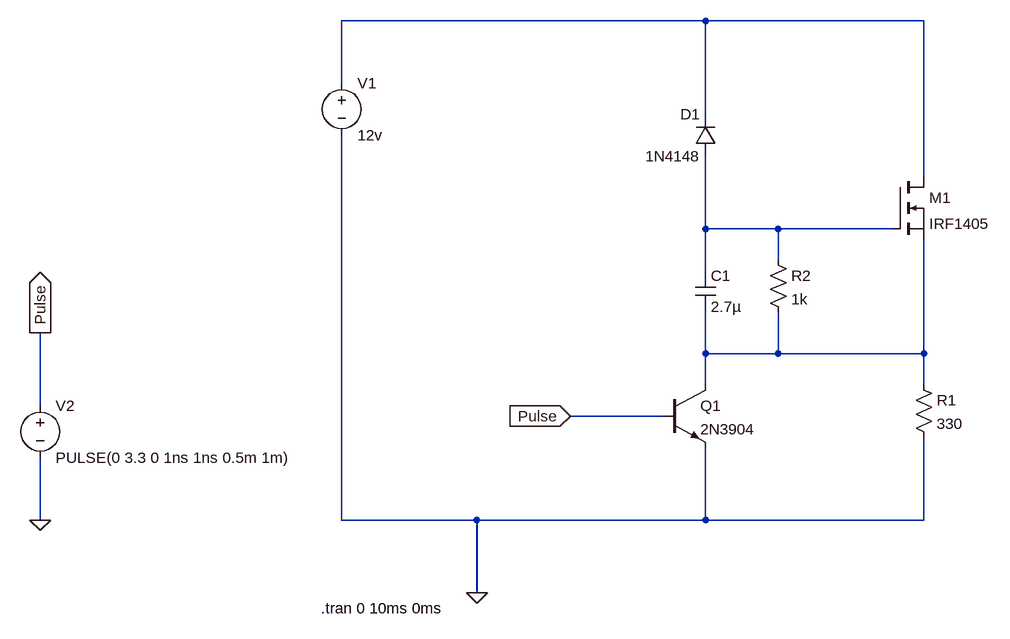
[diagram p0: schematic Boostrap.asc]
Boostrap.asc, the LTspice schematic file:
Version 4
SHEET 1 1072 808
WIRE 624 -112 64 -112
WIRE 960 -112 624 -112
WIRE 64 -16 64 -112
WIRE 624 32 624 -112
WIRE 960 128 960 -112
WIRE 624 208 624 96
WIRE 736 208 624 208
WIRE 912 208 736 208
WIRE 736 256 736 208
WIRE 624 272 624 208
WIRE 624 400 624 336
WIRE 736 400 736 336
WIRE 736 400 624 400
WIRE 960 400 960 224
WIRE 960 400 736 400
WIRE 624 448 624 400
WIRE 960 448 960 400
WIRE -400 480 -400 368
WIRE 560 496 416 496
WIRE -400 656 -400 560
WIRE 64 656 64 64
WIRE 272 656 64 656
WIRE 624 656 624 544
WIRE 624 656 272 656
WIRE 960 656 960 528
WIRE 960 656 624 656
WIRE 272 768 272 656
FLAG 272 768 0
FLAG -400 368 Pulse
IOPIN -400 368 Out
FLAG -400 656 0
FLAG 416 496 Pulse
IOPIN 416 496 In
SYMBOL voltage 64 -32 R0
WINDOW 123 0 0 Left 0
WINDOW 39 0 0 Left 0
SYMATTR InstName V1
SYMATTR Value 12v
SYMBOL nmos 912 128 R0
SYMATTR InstName M1
SYMATTR Value IRF1405
SYMBOL diode 640 96 R180
WINDOW 0 24 64 Left 2
WINDOW 3 24 0 Left 2
SYMATTR InstName D1
SYMATTR Value 1N4148
SYMBOL cap 608 272 R0
SYMATTR InstName C1
SYMATTR Value 2.7µ
SYMBOL res 944 432 R0
SYMATTR InstName R1
SYMATTR Value 330
SYMBOL npn 560 448 R0
SYMATTR InstName Q1
SYMATTR Value 2N3904
SYMBOL voltage -400 464 R0
WINDOW 123 0 0 Left 0
WINDOW 39 0 0 Left 0
SYMATTR InstName V2
SYMATTR Value PULSE(0 3.3 0 1ns 1ns 0.5m 1m)
SYMBOL res 720 240 R0
SYMATTR InstName R2
SYMATTR Value 1k
TEXT 32 792 Left 2 !.tran 0 10ms 0ms

The netlist it stands for:
* Boostrap.asc
V1 N001 0 12v
M1 N001 N002 N003 N003 IRF1405
D1 N002 N001 1N4148
C1 N002 N003 2.7µ
R1 N003 0 330
Q1 N003 Pulse 0 0 2N3904
V2 Pulse 0 PULSE(0 3.3 0 1ns 1ns 0.5m 1m)
R2 N002 N003 1k
.model D D
.lib standard.dio
.model NPN NPN
.model PNP PNP
.lib standard.bjt
.model NMOS NMOS
.model PMOS PMOS
.lib standard.mos
.tran 0 10ms 0ms
.backanno
.end